# EAGLE schematic Cables_RJ45 v49 (EAGLE 9.7.0)
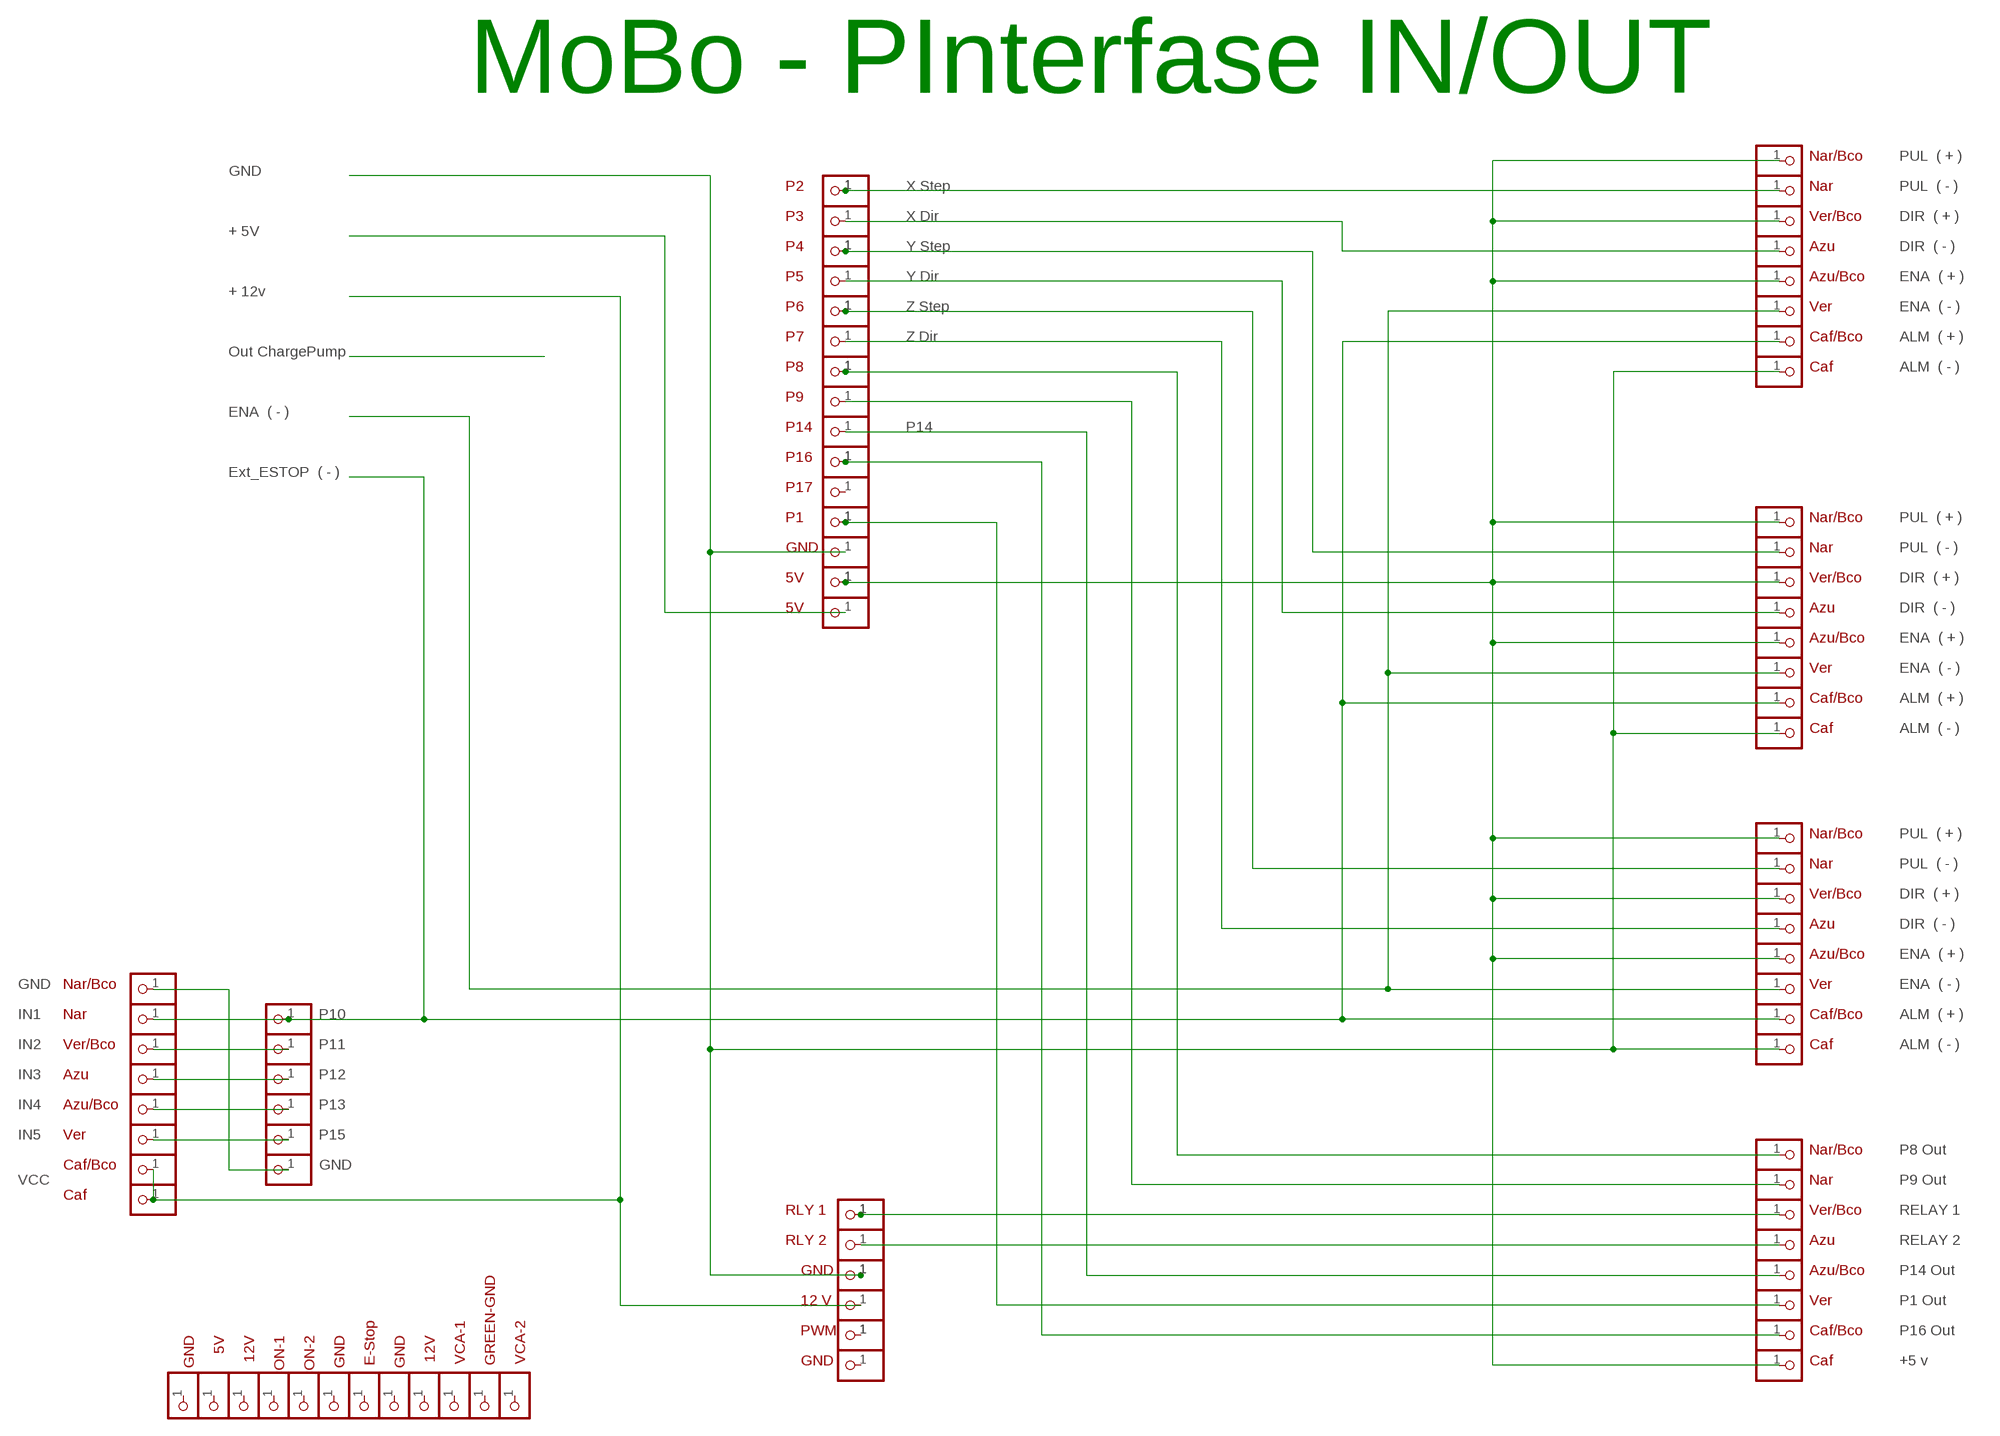
[diagram p0: schematic, sheet 1]

## Parts
JP1  ioiooo  PINHD-1X1  [1X01]
JP2  ioiooo  PINHD-1X1  [1X01]
JP3  ioiooo  PINHD-1X1  [1X01]
JP4  ioiooo  PINHD-1X1  [1X01]
JP5  ioiooo  PINHD-1X1  [1X01]
JP6  ioiooo  PINHD-1X1  [1X01]
JP7  ioiooo  PINHD-1X1  [1X01]
JP8  ioiooo  PINHD-1X1  [1X01]
JP9  ioiooo  PINHD-1X1  [1X01]
JP10  ioiooo  PINHD-1X1  [1X01]
JP11  ioiooo  PINHD-1X1  [1X01]
JP12  ioiooo  PINHD-1X1  [1X01]
JP13  ioiooo  PINHD-1X1  [1X01]
JP14  ioiooo  PINHD-1X1  [1X01]
JP15  ioiooo  PINHD-1X1  [1X01]
JP16  ioiooo  PINHD-1X1  [1X01]
JP17  ioiooo  PINHD-1X1  [1X01]
JP18  ioiooo  PINHD-1X1  [1X01]
JP19  ioiooo  PINHD-1X1  [1X01]
JP20  ioiooo  PINHD-1X1  [1X01]
JP21  ioiooo  PINHD-1X1  [1X01]
JP22  ioiooo  PINHD-1X1  [1X01]
JP23  ioiooo  PINHD-1X1  [1X01]
JP24  ioiooo  PINHD-1X1  [1X01]
JP25  ioiooo  PINHD-1X1  [1X01]
JP26  ioiooo  PINHD-1X1  [1X01]
JP27  ioiooo  PINHD-1X1  [1X01]
JP28  ioiooo  PINHD-1X1  [1X01]
JP29  ioiooo  PINHD-1X1  [1X01]
JP30  ioiooo  PINHD-1X1  [1X01]
JP31  ioiooo  PINHD-1X1  [1X01]
JP32  ioiooo  PINHD-1X1  [1X01]
JP33  ioiooo  PINHD-1X1  [1X01]
JP34  ioiooo  PINHD-1X1  [1X01]
JP35  ioiooo  PINHD-1X1  [1X01]
JP36  ioiooo  PINHD-1X1  [1X01]
JP37  ioiooo  PINHD-1X1  [1X01]
JP38  ioiooo  PINHD-1X1  [1X01]
JP39  ioiooo  PINHD-1X1  [1X01]
JP40  ioiooo  PINHD-1X1  [1X01]
JP41  ioiooo  PINHD-1X1  [1X01]
JP42  ioiooo  PINHD-1X1  [1X01]
JP43  ioiooo  PINHD-1X1  [1X01]
JP44  ioiooo  PINHD-1X1  [1X01]
JP45  ioiooo  PINHD-1X1  [1X01]
JP46  ioiooo  PINHD-1X1  [1X01]
JP47  ioiooo  PINHD-1X1  [1X01]
JP48  ioiooo  PINHD-1X1  [1X01]
JP49  ioiooo  PINHD-1X1  [1X01]
JP50  ioiooo  PINHD-1X1  [1X01]
JP51  ioiooo  PINHD-1X1  [1X01]
JP52  ioiooo  PINHD-1X1  [1X01]
JP53  ioiooo  PINHD-1X1  [1X01]
JP54  ioiooo  PINHD-1X1  [1X01]
JP55  ioiooo  PINHD-1X1  [1X01]
JP56  ioiooo  PINHD-1X1  [1X01]
JP57  ioiooo  PINHD-1X1  [1X01]
JP58  ioiooo  PINHD-1X1  [1X01]
JP59  ioiooo  PINHD-1X1  [1X01]
JP60  ioiooo  PINHD-1X1  [1X01]
JP61  ioiooo  PINHD-1X1  [1X01]
JP62  ioiooo  PINHD-1X1  [1X01]
JP63  ioiooo  PINHD-1X1  [1X01]
JP64  ioiooo  PINHD-1X1  [1X01]
JP65  ioiooo  PINHD-1X1  [1X01]
JP66  ioiooo  PINHD-1X1  [1X01]
JP67  ioiooo  PINHD-1X1  [1X01]
JP68  ioiooo  PINHD-1X1  [1X01]
JP69  ioiooo  PINHD-1X1  [1X01]
JP70  ioiooo  PINHD-1X1  [1X01]
JP71  ioiooo  PINHD-1X1  [1X01]
JP72  ioiooo  PINHD-1X1  [1X01]
JP73  ioiooo  PINHD-1X1  [1X01]
JP74  ioiooo  PINHD-1X1  [1X01]
JP75  ioiooo  PINHD-1X1  [1X01]
JP76  ioiooo  PINHD-1X1  [1X01]
JP77  ioiooo  PINHD-1X1  [1X01]
JP78  ioiooo  PINHD-1X1  [1X01]
JP79  ioiooo  PINHD-1X1  [1X01]
JP80  ioiooo  PINHD-1X1  [1X01]
JP81  ioiooo  PINHD-1X1  [1X01]
JP82  ioiooo  PINHD-1X1  [1X01]
JP83  ioiooo  PINHD-1X1  [1X01]
JP84  ioiooo  PINHD-1X1  [1X01]
JP85  ioiooo  PINHD-1X1  [1X01]
JP86  ioiooo  PINHD-1X1  [1X01]
JP87  ioiooo  PINHD-1X1  [1X01]
JP88  ioiooo  PINHD-1X1  [1X01]
JP89  ioiooo  PINHD-1X1  [1X01]

## Nets
N$1: JP2.1 JP3.1 JP4.1
N$2: JP6.1 JP7.1 JP34.1
N$3: JP9.1 JP10.1 JP42.1
N$4: JP12.1 JP13.1 JP27.1
N$5: JP5.1 JP16.1
N$6: JP8.1 JP36.1
N$7: JP33.1
N$8: JP22.1 JP23.1 JP53.1
N$9: JP25.1 JP26.1 JP52.1
N$10: JP11.1 JP44.1
N$11: JP1.1 JP15.1 JP17.1 JP29.1 JP31.1 JP32.1 JP35.1 JP37.1 JP41.1 JP43.1 JP45.1 JP54.1
N$12: JP20.1 JP30.1 JP40.1 JP48.1 JP58.1 JP59.1
N$13: JP49.1 JP55.1 JP56.1
N$14: JP18.1 JP38.1 JP46.1
N$15: JP61.1 JP62.1
N$16: JP50.1 JP57.1
N$17: JP14.1 JP28.1
N$20: JP21.1 JP51.1
N$21: JP19.1 JP39.1 JP47.1 JP64.1 JP70.1
N$22: JP69.1 JP76.1
N$23: JP65.1 JP71.1
N$24: JP66.1 JP72.1
N$25: JP67.1 JP73.1
N$26: JP68.1 JP74.1
N$27: JP60.1 JP75.1 JP77.1
Unconnected: JP24.1 JP63.1 JP78.1 JP79.1 JP80.1 JP81.1 JP82.1 JP83.1 JP84.1 JP85.1 JP86.1 JP87.1 JP88.1 JP89.1

## Notes on the sheet
- Nar/Bco | PUL  ( + )
- GND
- P2 | X Step | Nar | PUL  ( - )
- MoBo - PInterfase IN/OUT
- P3 | X Dir | Ver/Bco | DIR  ( + )
- + 5V
- P4 | Y Step | Azu | DIR  ( - )
- P5 | Y Dir | Azu/Bco | ENA  ( + )
- + 12v
- P6 | Z Step | Ver | ENA  ( - )
- P7 | Z Dir | Caf/Bco | ALM  ( + )
- Out ChargePump
- P8 | Caf | ALM  ( - )
- P9
- ENA  ( - )
- P14 | P14
- P16
- Ext_ESTOP  ( - )
- P17
- P1 | Nar/Bco | PUL  ( + )
- GND | Nar | PUL  ( - )
- 5V | Ver/Bco | DIR  ( + )
- 5V | Azu | DIR  ( - )
- Azu/Bco | ENA  ( + )
- Ver | ENA  ( - )
- Caf/Bco | ALM  ( + )
- Caf | ALM  ( - )
- Nar/Bco | PUL  ( + )
- Nar | PUL  ( - )
- Ver/Bco | DIR  ( + )
- Azu | DIR  ( - )
- Azu/Bco | ENA  ( + )
- GND | Nar/Bco | Ver | ENA  ( - )
- IN1 | Nar | P10 | Caf/Bco | ALM  ( + )
- IN2 | Ver/Bco | P11 | Caf | ALM  ( - )
- IN3 | Azu | P12
- IN4 | Azu/Bco | P13
- IN5 | Ver | P15
- Nar/Bco | P8 Out
- Caf/Bco | GND
- VCC | Nar | P9 Out
- Caf
- RLY 1 | Ver/Bco | RELAY 1
- RLY 2 | Azu | RELAY 2
- GREEN-GND | GND | Azu/Bco | P14 Out
- 12 V | Ver | P1 Out
- E-Stop | VCA-1 | VCA-2
- GND | 5V | 12V | ON-1 | ON-2 | GND | GND | 12V | PWM | Caf/Bco | P16 Out
- GND | Caf | +5 v

## Library data of the parts
JP1-JP89 = Connector:PINHD-1X1: PIN HEADER; CATEGORY: Headers; DESCRIPTION: Header, Straight, 1 Position; MANUFACTURER: Generic; MPN: Generic; OPERATING_TEMPERATURE: Generic; PART_STATUS: Active; PITCH: 0.100" (2.54mm); ROHS_COMPLIANCE: Generic; SERIES: Generic; SUB-CATEGORY: Headers, Male Pins; TYPE: Board to Board or Cable, Unshrouded, Through Hole, Straight